# Altium schematic sheet LDR SHEET.SchDoc
size A4
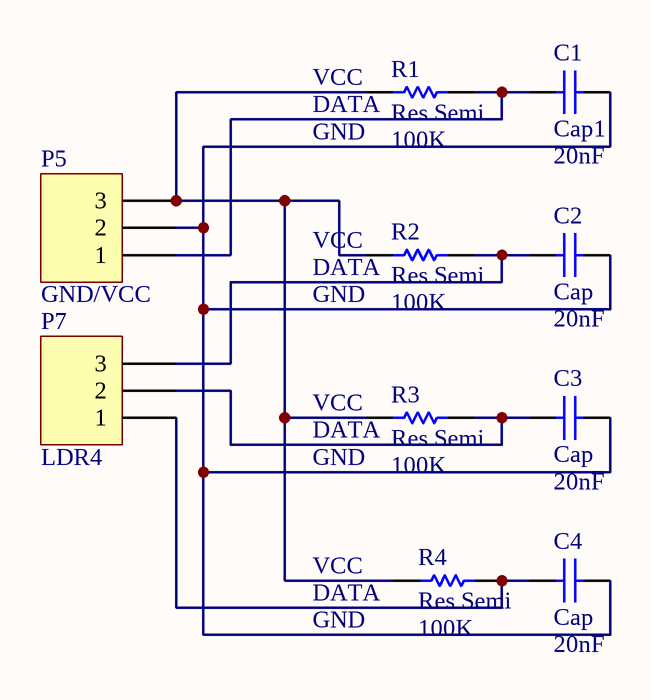
[diagram p0: LDR SHEET.SchDoc]

## Parts
C1  Cap1  value 20nF  [RAD-0.3]
C2  Cap  value 20nF  [RAD-0.3]
C3  Cap  value 20nF  [RAD-0.3]
C4  Cap  value 20nF  [RAD-0.3]
P5  GND/VCC  [HDR1X3]
P7  LDR4  [HDR1X3]
R1  Res Semi  value 100K  [AXIAL-0.5]
R2  Res Semi  value 100K  [AXIAL-0.5]
R3  Res Semi  value 100K  [AXIAL-0.5]
R4  Res Semi  value 100K  [AXIAL-0.5]

## Nets
NetC1_1: C1.1 P5.1 R1.1
NetC1_2: C1.2 C2.2 C3.2 C4.2 P5.2
NetC2_1: C2.1 P7.3 R2.1
NetC3_1: C3.1 P7.2 R3.1
NetC4_1: C4.1 P7.1 R4.1
NetP5_3: P5.3 R1.2 R2.2 R3.2 R4.2

## Notes on the sheet
- (near R1) VCC
- (near R1) DATA
- (near R1) GND
- (near R2) VCC
- (near R2) DATA
- (near R2) GND
- (near R3) VCC
- (near R3) DATA
- (near R3) GND
- (near R4) VCC
- (near R4) DATA
- (near R4) GND

## Library data of the parts
C1-C4 = Cap: Capacitor; Published: 8-Jun-2000; LatestRevisionDate: 17-Jul-2002; LatestRevisionNote: Re-released for DXP Platform.; PackageReference: RAD-0.3; Publisher: Altium Limited; PackageDescription: Radial Cap, Thru-Hole; 2 Leads; 0.3 in Pin Spacing
P5 P7 = Header 3: Header, 3-Pin; LatestRevisionDate: 17-Jul-2002; LatestRevisionNote: Re-released for DXP Platform.; Publisher: Altium Limited
R1-R4 = Res Semi: Semiconductor Resistor; Published: 8-Jun-2000; LatestRevisionDate: 17-Jul-2002; LatestRevisionNote: Re-released for DXP Platform.; PackageReference: AXIAL-0.5; Publisher: Altium Limited; PackageDescription: Axial Device, Thru-Hole; 2 Leads; 0.5 in Pin Spacing